# Altium project QuadCape_2Layer.PrjPcb
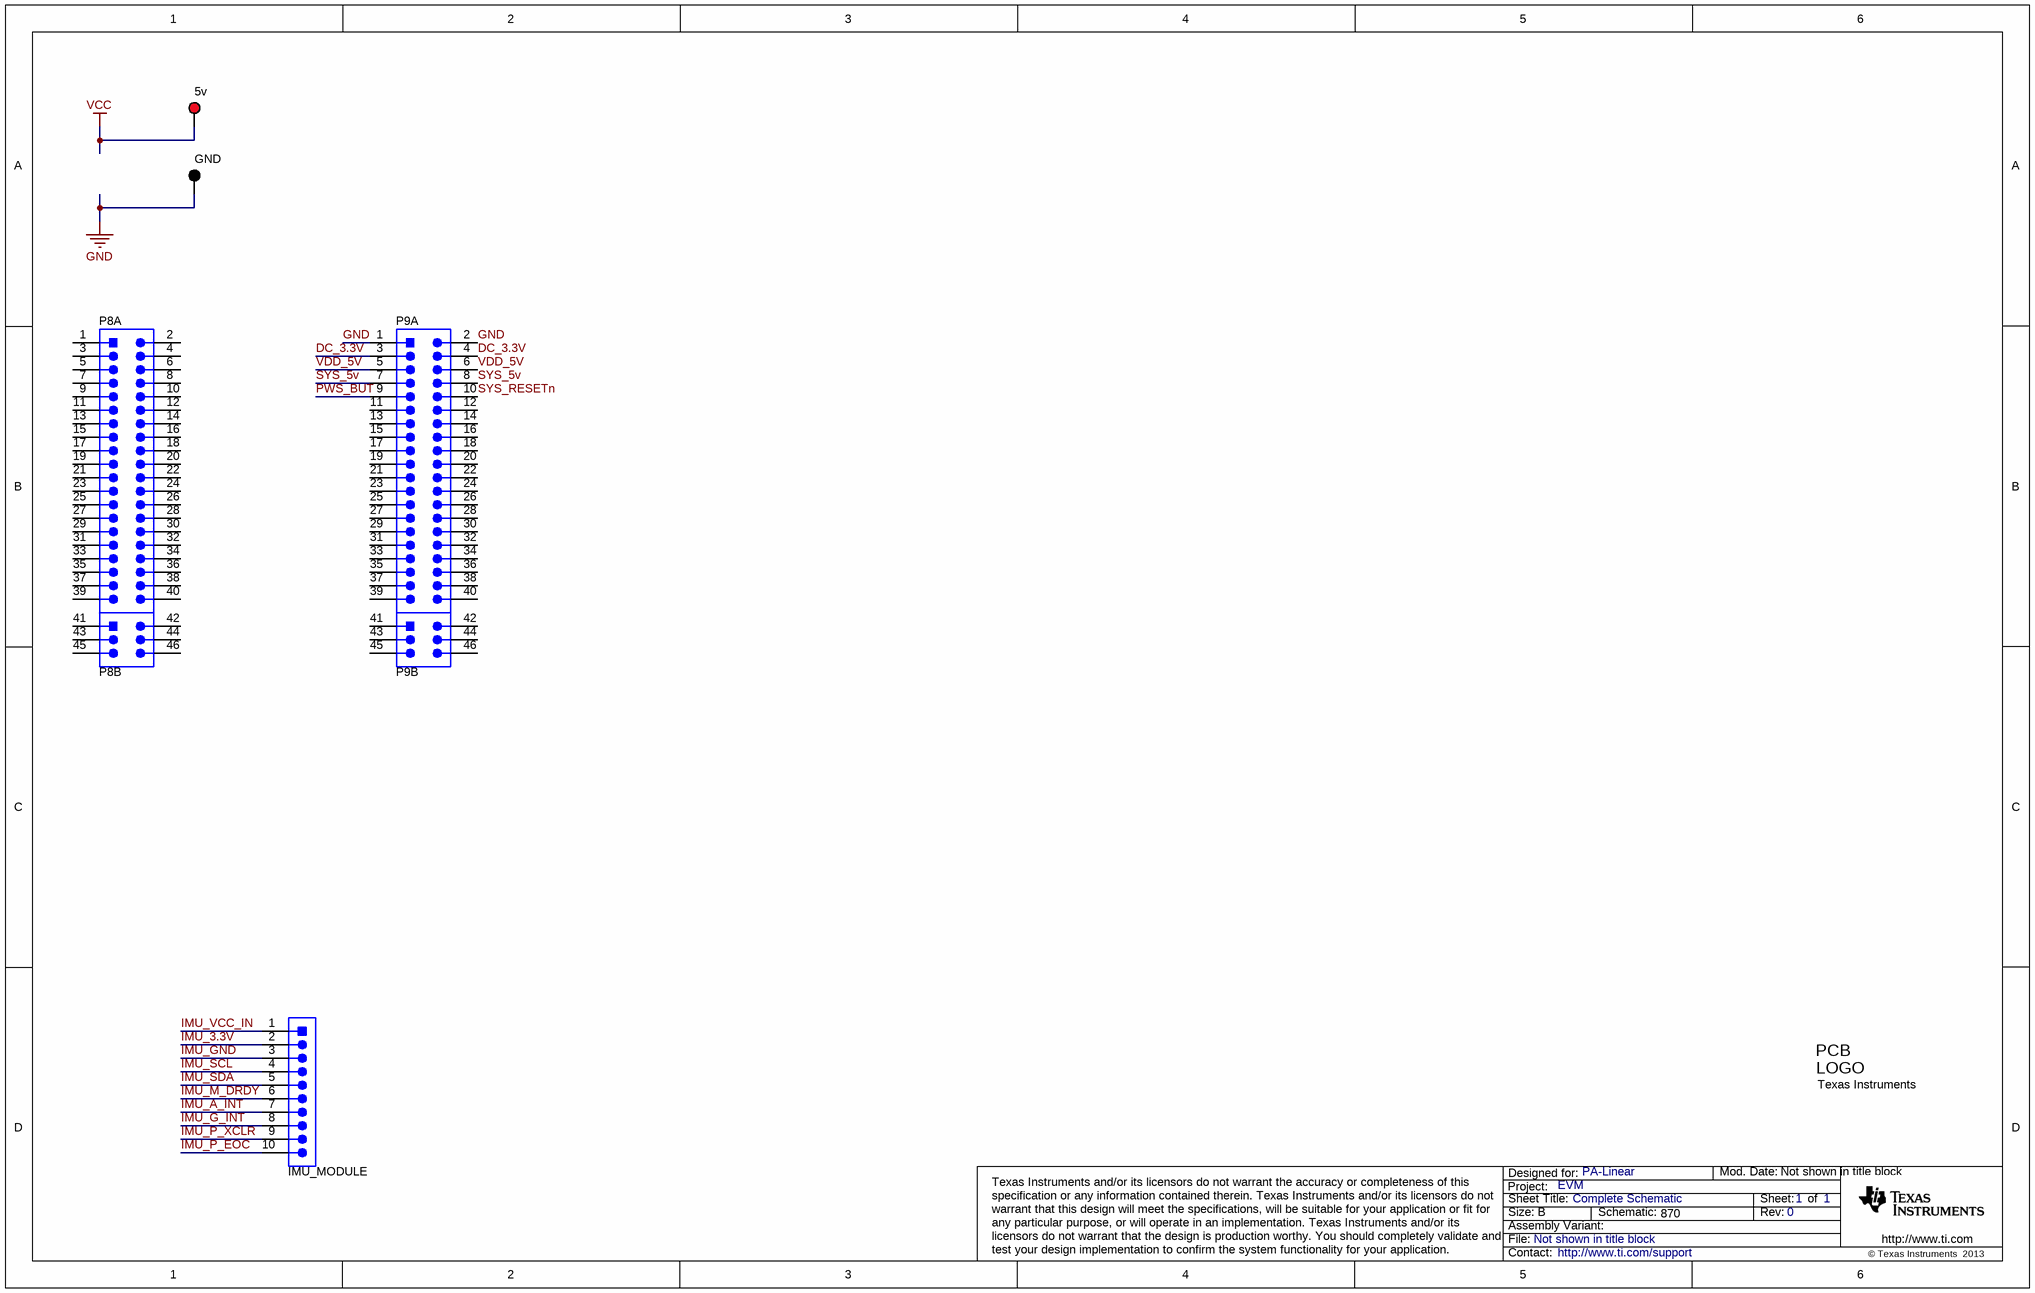
[diagram p0: QuadCape_SCH.SchDoc]
CopyrightYear: 2013; PRJ_Customer: PA-Linear; PRJ_Title: EVM; SCH_Rev: 0; TechSupport: http://www.ti.com/support
1 sheet, 8 parts. Net scope: global (net labels, ports and power ports of the same name join across sheets).
Board file: QuadCape_PCB.PcbDoc

## Sheet QuadCape_SCH.SchDoc: Complete Schematic
size B; Date: Not shown in title block; ApprovedBy: Not shown in title block; CheckedBy: Not shown in title block; Author: Not shown in title block; CompanyName: Not shown in title block; DrawnBy: Not shown in title block; Engineer: Not shown in title block; Organization: Not shown in title block; Address1: Not shown in title block; Address2: Not shown in title block; Address3: Not shown in title block; Address4: Not shown in title block; DocumentNumber: 1; Revision: Use project parameter SCH_Rev; SheetNumber: 1; SheetTotal: 1; PageSetup: Record=PageOptions|CenterHorizontal=True|CenterVertical=True|PrintScale=0.72|XCorrection=1.00|YCorrection=1.00|PrintKind=0|BorderSize=5000000|LeftOffset=0|BottomOffset=0|Orientation=2|PaperLength=1000|PaperWidth=1000|Scale=100|PaperSource=15|PrintQuality=600|MediaType=1|DitherType=10|PaperKind=Letter|PrintScaleMode=1; CurrentTime: Not shown in title block; CurrentDate: Not shown in title block; Time: Not shown in title block; DocumentFullPathAndName: Not shown in title block; DocumentName: Not shown in title block; ModifiedDate: Not shown in title block; ImagePath: Not shown in title block

### Parts
5v  5005  [Keystone5005]  (value not drawn)
GND  5006  [Keystone5006]  (value not drawn)
IMU_MODULE  800-10-010-10-001000  [Mill-Max_800-10-010-10-001000]  (value not drawn)
Logo1  Texas Instruments  [TI_Symbol_Overlay_Small]  (no BOM)
P8A  Comment  [TSW-120-07-G-D]  (value not drawn)
P8B  Comment  [SULLINS_PEC03DAAN]  (value not drawn)
P9A  Comment  [TSW-120-07-G-D]  (value not drawn)
P9B  Comment  [SULLINS_PEC03DAAN]  (value not drawn)

### Nets
GND: GND.1 P9A.1 P9A.2
VCC: 5v.1
DC_3.3V: P9A.3 P9A.4
IMU_3.3V: IMU_MODULE.2
IMU_A_INT: IMU_MODULE.7
IMU_G_INT: IMU_MODULE.8
IMU_GND: IMU_MODULE.3
IMU_M_DRDY: IMU_MODULE.6
IMU_P_EOC: IMU_MODULE.10
IMU_P_XCLR: IMU_MODULE.9
IMU_SCL: IMU_MODULE.4
IMU_SDA: IMU_MODULE.5
IMU_VCC_IN: IMU_MODULE.1
PWS_BUT: P9A.9
SYS_5v: P9A.7 P9A.8
SYS_RESETn: P9A.10
VDD_5V: P9A.5 P9A.6

Not connected (* = marked no-connect by the designer): P8A 1 2 3 4 5 6 7 8 9 10 11 12 13 14 15 16 17 18 19 20 21 22 23 24 25 26 27 28 29 30 31 32 33 34 35 36 37 38 39 40; P8B 41 42 43 44 45 46; P9A 11 12 13 14 15 16 17 18 19 20 21 22 23 24 25 26 27 28 29 30 31 32 33 34 35 36 37 38 39 40; P9B 41 42 43 44 45 46

### Notes on the sheet
- Project:
- Designed for:
- Mod. Date:
- Sheet Title:
- Size:
- File:
- Assembly Variant:
- B
- Schematic:
- 870
- Rev:
- Sheet:
- of
- http://www.ti.com
- Texas Instruments and/or its licensors do not warrant the accuracy or completeness of this specification or any information contained therein. Texas Instruments and/or its licensors do not warrant that this design will meet the specifications, will be suitable for your application or fit for any particular purpose, or will operate in an implementation. Texas Instruments and/or its licensors do not warrant that the design is production worthy. You should completely validate and test your design implementation to confirm the system functionality for your application.
- Contact:
- © Texas Instruments
- (in symbol TI_Logo) PCB; LOGO

### Library data of the parts
5v = 5005: Test Point, TH, Compact, Red; Manufacturer: Keystone; Alternate Manufacturer: Any; Alternate PartNumber: Equivalent; CompType: Test Point Loop; U/M: EA; RoHS: Y; DigiKeyPartNumber: 5005K-ND; Value: Red; SymbolVersion: 2008-04-04; PartNumber: 5005; PackageReference: Keystone5005; ComponentLink1Description: Datasheet Link; ComponentLink1URL: http://www.keyelco.com/pdfs/M55p51.pdf; MountType: TH; Publisher: Texas Instruments; LatestRevisionDate: 2012-07-13; LatestRevisionNote: Changed publisher; Supplier 1: Digi-Key; Supplier Part Number 1: 5005K-ND
GND = 5006: Test Point, TH, Compact, Black; Manufacturer: Keystone; Alternate Manufacturer: Any; Alternate PartNumber: Equivalent; CompType: Test Point Loop; U/M: EA; RoHS: Y; DigiKeyPartNumber: 5006K-ND; Value: Black; SymbolVersion: 2008-04-04; PartNumber: 5006; PackageReference: Keystone5006; ComponentLink1Description: Datasheet Link; ComponentLink1URL: http://www.keyelco.com/pdfs/M55p51.pdf; MountType: TH; Publisher: Texas Instruments; LatestRevisionDate: 2012-07-13; LatestRevisionNote: Changed publisher; Supplier 1: Digi-Key; Supplier Part Number 1: 5006K-ND
IMU_MODULE = 800-10-010-10-001000: Header, 10x1, 100mil, SMT; Manufacturer: Mill-Max; SymbolCreator: a0412235; U/M: EA; SymbolVersion: 2013-12-22; PartNumber: 800-10-010-10-001000; PackageReference: Header, 10x1, 100mil, TH; CompType: Header; RoHS: Y; MountType: TH; ComponentLink1Description: Datasheet Link; ComponentLink1URL: http://www.mill-max.com/assets/pdfs/054.PDF; Publisher: Texas Instruments; LatestRevisionDate: 2014-06-18; Supplier 1: Digi-Key; Supplier Part Number 1: ED7210-ND
Logo1 = TI_Logo: Texas Instrument Corporate Signature; SymbolCreator: codlsc; SymbolVersion: 2011-08-22; ClassName: Logo; Published: 2009-03-03; Publisher: Texas Instruments; LatestRevisionDate: 2012-05-17; LatestRevisionNote: Changed publisher
P8A P9A = TSW-120-07-G-D: Header, 100mil, 20x2, Gold, TH; Manufacturer: Samtec; SymbolCreator: a0412235; U/M: EA; SymbolVersion: 2013-10-14; PartNumber: TSW-120-07-G-D; ClassName: Header; PackageReference: 20x2 Header; CompType: Header; RoHS: Y; MountType: TH; ComponentLink1Description: Datasheet Link; ComponentLink1URL: http://samtec.com/ftppub/pdf/TSW_TH.PDF; Publisher: Texas Instruments; LatestRevisionDate: 2014-06-17; Supplier 1: Digi-Key; Supplier Part Number 1: SAM1028-20-ND
P8B P9B = PEC03DAAN: Header, 100mil, 3x2, Tin, TH; Manufacturer: Sullins Connector Solutions; SymbolCreator: a0412235; U/M: EA; SymbolVersion: 2013-10-14; PartNumber: PEC03DAAN; ClassName: Header; PackageReference: 3x2 Header; CompType: Header; RoHS: Y; MountType: TH; ComponentLink1Description: Datasheet Link; ComponentLink1URL: http://www.sullinscorp.com/catalogs/97_Page78-79_HEADER_.100_2.54mm_MALE_BREAKAWAY.pdf; Publisher: Texas Instruments; LatestRevisionDate: 2014-06-17; Supplier 1: Digi-Key; Supplier Part Number 1: S2012E-03-ND

## Assembly variants
-100A: all parts fitted